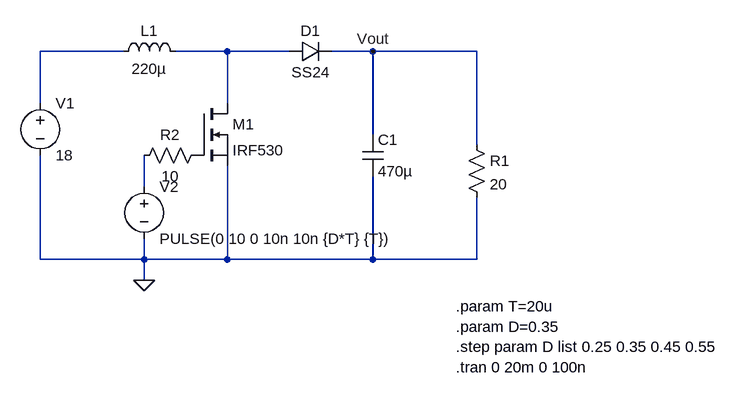
[diagram p0: schematic boost_converter.asc]
boost_converter.asc, the LTspice schematic file:
Version 4.1
SHEET 1 1192 680
WIRE 240 64 112 64
WIRE 400 64 320 64
WIRE 496 64 400 64
WIRE 624 64 560 64
WIRE 784 64 624 64
WIRE 112 144 112 64
WIRE 400 144 400 64
WIRE 624 192 624 64
WIRE 784 208 784 64
WIRE 272 272 272 224
WIRE 112 384 112 224
WIRE 272 384 272 352
WIRE 272 384 112 384
WIRE 400 384 400 240
WIRE 400 384 272 384
WIRE 624 384 624 256
WIRE 624 384 400 384
WIRE 784 384 784 288
WIRE 784 384 624 384
WIRE 272 416 272 384
FLAG 272 416 0
FLAG 624 64 Vout
SYMBOL voltage 112 128 R0
WINDOW 123 0 0 Left 0
WINDOW 39 0 0 Left 0
SYMATTR InstName V1
SYMATTR Value 18
SYMBOL ind 224 80 R270
WINDOW 0 32 56 VTop 2
WINDOW 3 5 56 VBottom 2
SYMATTR InstName L1
SYMATTR Value 220µ
SYMATTR SpiceLine Rser=1m
SYMBOL diode 496 80 R270
WINDOW 0 32 32 VTop 2
WINDOW 3 0 32 VBottom 2
SYMATTR InstName D1
SYMATTR Value SS24
SYMATTR Description Diode
SYMATTR Type diode
SYMBOL nmos 352 144 R0
SYMATTR InstName M1
SYMATTR Value IRF530
SYMBOL voltage 272 256 R0
WINDOW 123 0 0 Left 0
WINDOW 39 0 0 Left 0
SYMATTR InstName V2
SYMATTR Value PULSE(0 10 0 10n 10n {D*T} {T})
SYMBOL cap 608 192 R0
SYMATTR InstName C1
SYMATTR Value 470µ
SYMBOL res 768 192 R0
SYMATTR InstName R1
SYMATTR Value 20
SYMBOL res 368 208 R90
WINDOW 0 0 56 VBottom 2
WINDOW 3 32 56 VTop 2
SYMATTR InstName R2
SYMATTR Value 10
TEXT 752 456 Left 2 !.param T=20u\n.param D=0.35\n.step param D list 0.25 0.35 0.45 0.55\n.tran 0 20m 0 100n

The netlist it stands for:
* boost_converter.asc
V1 N001 0 18
L1 N001 N002 220µ Rser=1m
D1 N002 Vout SS24
M1 N002 P001 0 0 IRF530
V2 N003 0 PULSE(0 10 0 10n 10n {D*T} {T})
C1 Vout 0 470µ
R1 Vout 0 20
R2 P001 N003 10
.model D D
.lib standard.dio
.model NMOS NMOS
.model PMOS PMOS
.lib standard.mos
.param T=20u
.param D=0.35
.step param D list 0.25 0.35 0.45 0.55
.tran 0 20m 0 100n
.backanno
.end